# Altium schematic sheet Regulators.SchDoc
size A4; Organization: Altium Limited; Address1: L3, 12a Rodborough Rd; Address2: Frenchs Forest; Address3: NSW; Address4: Australia 2086
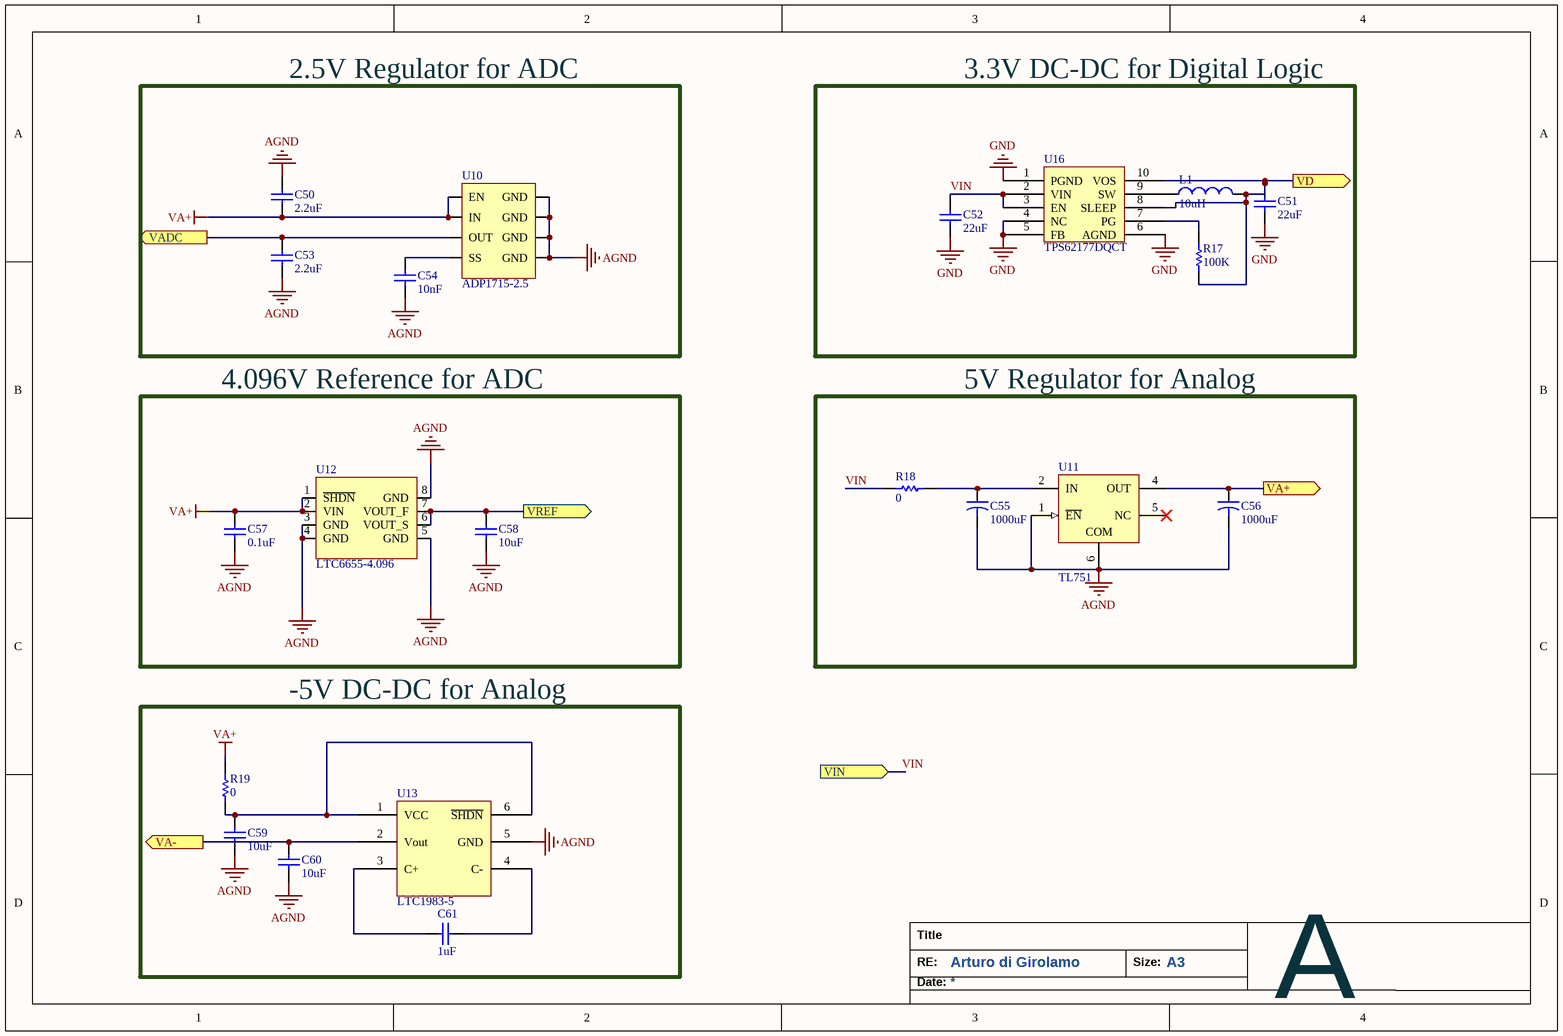
[diagram p0: Regulators.SchDoc]

## Parts
C50  2.2uF  [STD_0805_C]
C51  22uF  [STD_0805_C]
C52  22uF  [STD_0805_C]
C53  2.2uF  [STD_0805_C]
C54  10nF  [STD_0805_C]
C55  1000uF  [UVR1V102MHD1TO]
C56  1000uF  [UVR1V102MHD1TO]
C57  0.1uF  [STD_0805_C]
C58  10uF  [STD_0805_C]
C59  10uF  [STD_0805_C]
C60  10uF  [STD_0805_C]
C61  1uF  [STD_0805_C]
L1  10uH  [IHLP2020BZER100M01]
R17  100K  [STD_0805_R]
R18  0  [STD_0805_R]
R19  0  [STD_0805_R]
U10  ADP1715-2.5  [MSOP_8]
U11  TL751  [TL751]
U12  LTC6655-4.096  [MSOP_8]
U13  LTC1983-5  [SOT23-6_M]
U16  TPS62177DQCT  [TPS62177]

## Blocks framed on the sheet
2.5V Regulator for ADC: C50 C53 C54 U10
3.3V DC-DC for Digital Logic: C51 C52 L1 R17 U16
4.096V Reference for ADC: C57 C58 U12
5V Regulator for Analog: C55 C56 R18 U11
-5V DC-DC for Analog: C59-C61 R19 U13

## Ports
VA+ (out), VA- (out), VADC (out), VD (out), VIN (in), VREF (out)

## Nets
AGND: C50.2 C53.1 C54.1 C55.2 C56.2 C57.1 C58.1 C59.1 C60.1 U10.5(GND) U10.6(GND) U10.7(GND) U10.8(GND) U11.1(~{EN}) U11.6(COM) U12.3(GND) U12.4(GND) U12.5(GND) U12.8(GND) U13.5(GND)
GND: C51.1 C52.1 U16.1(PGND) U16.4(NC) U16.5(FB) U16.6(AGND)
VA+: C50.1 C57.2 R19.2 U10.1(EN) U10.2(IN) U12.1(~{SHDN}) U12.2(VIN)
VA+: C56.1 U11.4(OUT) ; port VA+  [a separate net that carries the same name]
VA-: C60.2 U13.2(Vout) ; port VA-
VADC: C53.2 U10.3(OUT) ; port VADC
VD: C51.2 L1.2 R17.1 U16.8(SLEEP) U16.10(VOS) ; port VD
VIN: C52.2 R18.1 U16.2(VIN) U16.3(EN) ; port VIN
VREF: C58.2 U12.6(VOUT_S) U12.7(VOUT_F) ; port VREF
NetC54_2: C54.2 U10.4(SS)
NetC55_1: C55.1 R18.2 U11.2(IN)
NetC59_2: C59.2 R19.1 U13.1(VCC) U13.6(~{SHDN})
NetC61_1: C61.1 U13.3(C+)
NetC61_2: C61.2 U13.4(C-)
NetL1_1: L1.1 U16.9(SW)
NetR17_2: R17.2 U16.7(PG)

Not connected (* = marked no-connect by the designer): U11 5(NC)*

## Notes on the sheet
- Title
- Date:
- RE:
- Arturo di Girolamo
- Size:
- A3
- A

## Library data of the parts
C50 C53 = CL21A225KAFNNNE: Capacitor, 2.2uF, 0805; Value: .01uf; MFGPN: CL21A225KAFNNNE
C51 C52 = GRM21BR61E226ME44L: Capacitor, 22uF, 0805, 25V; Value: .01uf; MFGPN: GRM21BR61E226ME44L
C54 = C0805C103K1RAC7210: Capacitor, 10nF, 0805; Value: .01uf; MFGPN: C0805C103K1RAC7210
C55 C56 = UVR1V102MHD1TO: Capacitor, 100uF NICHICON; MFGPN: UVR1V102MHD1TO
C57 = CL21B104KACNNNC: Capacitor, 0.1uF, 0805; Value: .01uf; MFGPN: CL21B104KACNNNC
C58-C60 = CL21A106KAFN3NE: Capacitor, 10uF, 0805; Value: .01uf; MFGPN: CL21A106KAFN3NE
C61 = CL21B105KBFNFNE: Capacitor, 1uF, 0805; Value: .01uf; MFGPN: CL21B105KBFNFNE
L1 = IHLP2020BZER100M01: Inductor 10uH VISHAY; MFGPN: IHLP2020BZER100M01
R17 = RR1220P-104-D: 100K 1% 1/10W; Value: 1K; MFGPN: RR1220P-104-D
R18 R19 = RMCF0805ZT0R00: 0 ohm jumper; Value: 0; MFGPN: RMCF0805ZT0R00
U10 = ADP1715ARMZ-2.5-R7: 2.5V linear regulator; MFGPN: ADP1715ARMZ-2.5-R7
U12 = LTC6655CHMS8-4.096#PBF: Voltage Reference 4.096V; MFGPN: LTC6655CHMS8-4.096#PBF
U13 = LTC1983ES6-5#TRPBF: -5V, DC-DC Converter; MFGPN: LTC1983ES6-5#TRPBF
U11 = TL751: MFGPN: TL751